# EAGLE design motoko_ice_dragon (EAGLE 9.6.0)
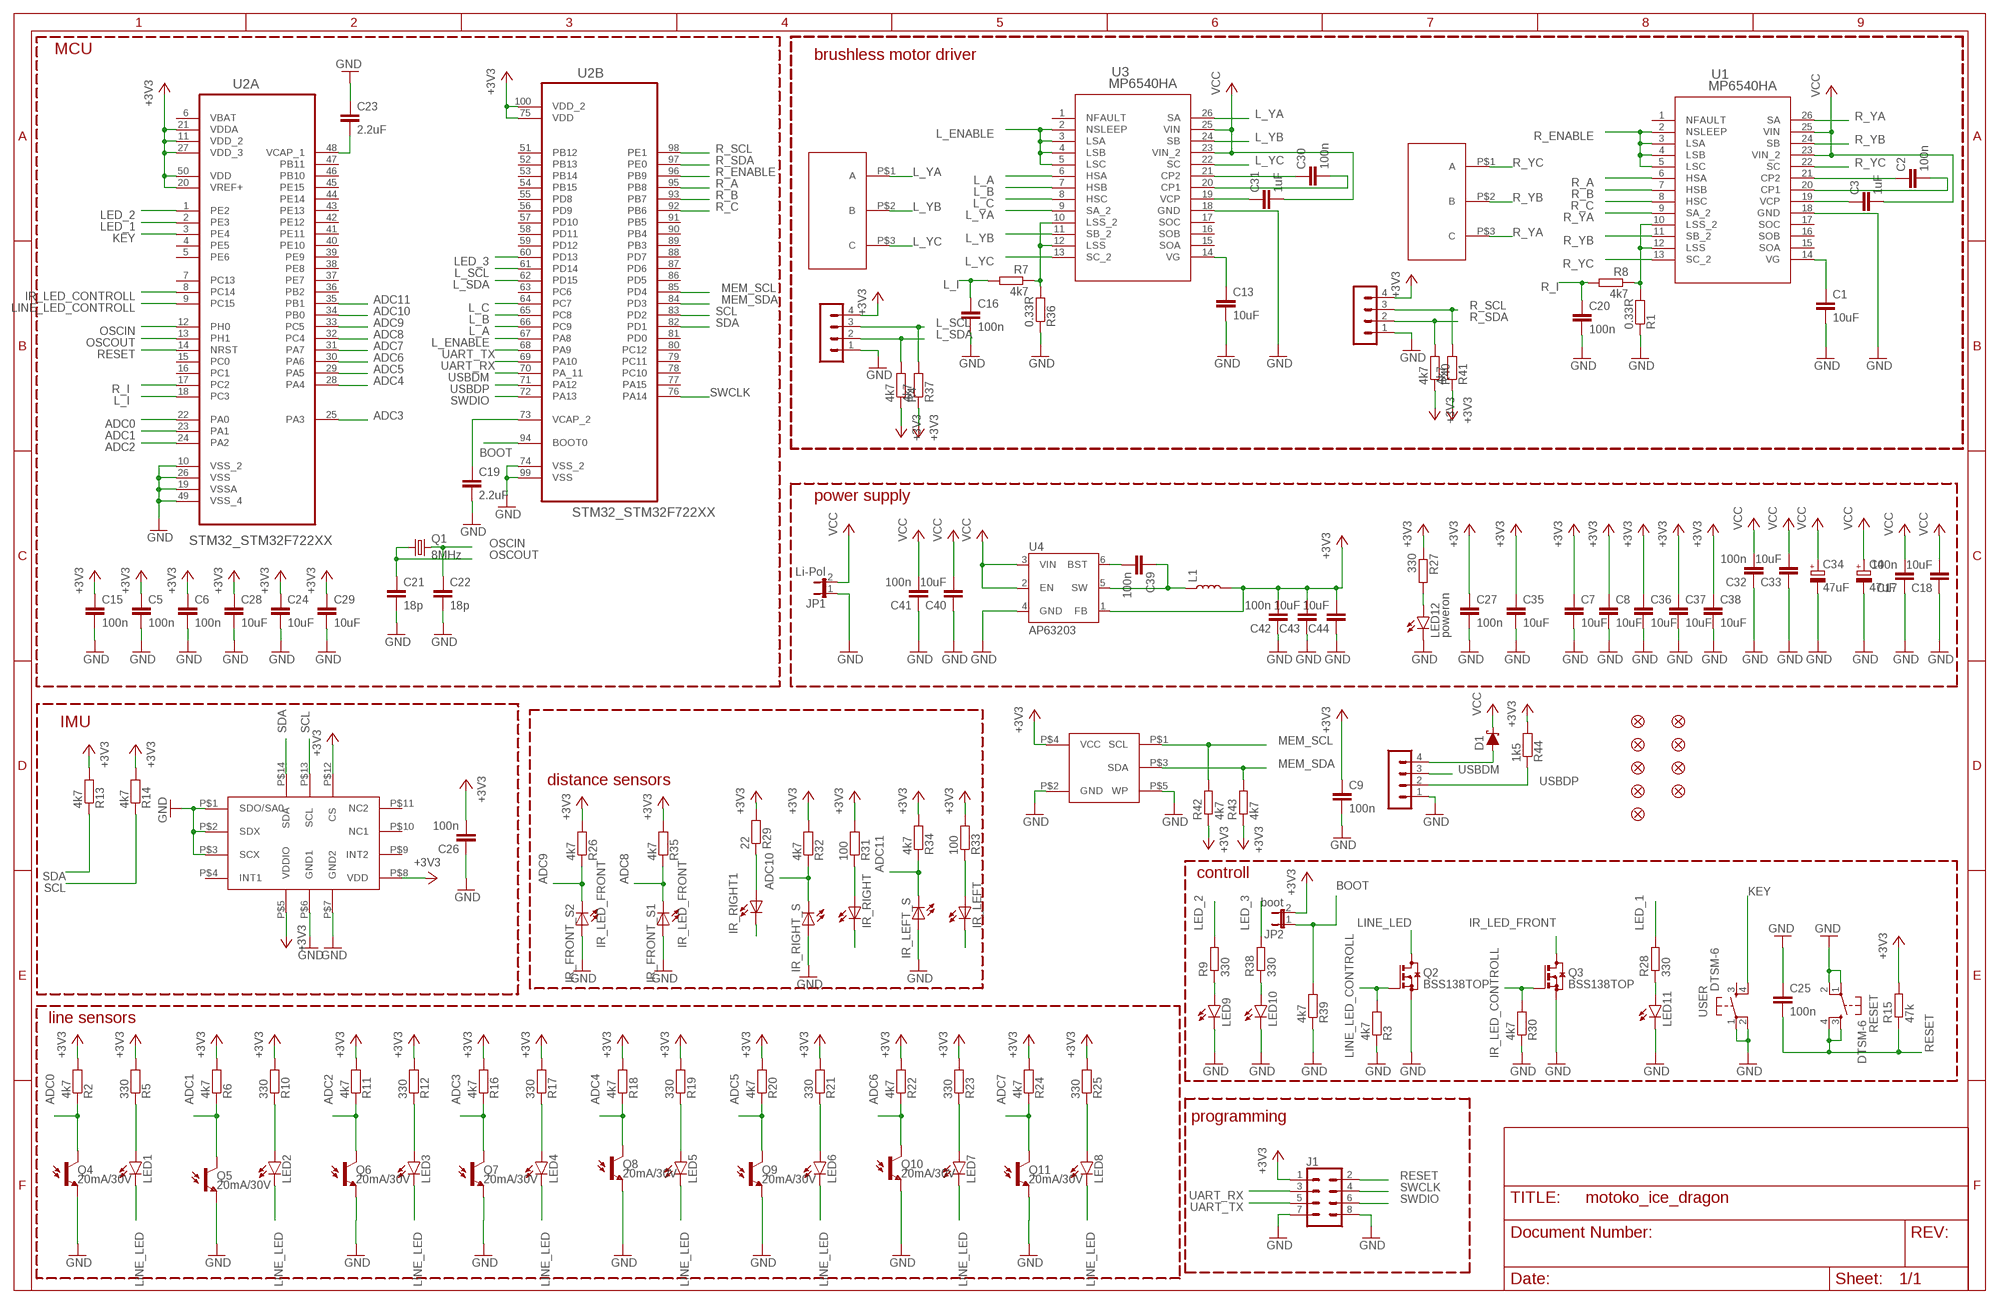
[diagram p0: schematic, sheet 1]

## Parts
C1  10uF  C-EUC0805  [C0805]
C2  100n  C-EUC0805  [C0805]
C3  1uF  C-EUC0805  [C0805]
C4  47uF  CPOL-EU140CLH-1010  [140CLH-1010]
C5  100n  C-EUC0805  [C0805]
C6  100n  C-EUC0805  [C0805]
C7  10uF  C-EUC0805  [C0805]
C8  10uF  C-EUC0805  [C0805]
C9  100n  C-EUC0805  [C0805]
C13  10uF  C-EUC0805  [C0805]
C15  100n  C-EUC0805  [C0805]
C16  100n  C-EUC0805  [C0805]
C17  100n  C-EUC0805  [C0805]
C18  10uF  C-EUC0805  [C0805]
C19  2.2uF  C-EUC0805  [C0805]
C20  100n  C-EUC0805  [C0805]
C21  18p  C-EUC0805  [C0805]
C22  18p  C-EUC0805  [C0805]
C23  2.2uF  C-EUC0805  [C0805]
C24  10uF  C-EUC0805  [C0805]
C25  100n  C-EUC0805  [C0805]
C26  100n  C-EUC0805  [C0805]
C27  100n  C-EUC0805  [C0805]
C28  10uF  C-EUC0805  [C0805]
C29  10uF  C-EUC0805  [C0805]
C30  100n  C-EUC0805  [C0805]
C31  1uF  C-EUC0805  [C0805]
C32  100n  C-EUC0805  [C0805]
C33  10uF  C-EUC0805  [C0805]
C34  47uF  CPOL-EU140CLH-1010  [140CLH-1010]
C35  10uF  C-EUC0805  [C0805]
C36  10uF  C-EUC0805  [C0805]
C37  10uF  C-EUC0805  [C0805]
C38  10uF  C-EUC0805  [C0805]
C39  100n  C-EUC0805  [C0805]
C40  10uF  C-EUC0805  [C0805]
C41  100n  C-EUC0805  [C0805]
C42  100n  C-EUC0805  [C0805]
C43  10uF  C-EUC0805  [C0805]
C44  10uF  C-EUC0805  [C0805]
D1  3A/40V/500mV  DIODE-SCHOTTKY-B340A  [SMA-DIODE]
FD1  FIDUCIAL1X2  [FIDUCIAL-1X2]
FD2  FIDUCIAL1X2  [FIDUCIAL-1X2]
FD3  FIDUCIAL1X2  [FIDUCIAL-1X2]
FD4  FIDUCIAL1X2  [FIDUCIAL-1X2]
FD5  FIDUCIAL1X2  [FIDUCIAL-1X2]
FD6  FIDUCIAL1X2  [FIDUCIAL-1X2]
FD7  FIDUCIAL1X2  [FIDUCIAL-1X2]
FD8  FIDUCIAL1X2  [FIDUCIAL-1X2]
FD9  FIDUCIAL1X2  [FIDUCIAL-1X2]
IR_FRONT_S1  LED5MM  [LED5MM]
IR_FRONT_S2  LED5MM  [LED5MM]
IR_LEFT  LED5MM  [LED5MM]
IR_LEFT_S  LED5MM  [LED5MM]
IR_RIGHT  LED5MM  [LED5MM]
IR_RIGHT1  LED5MM  [LED5MM]
IR_RIGHT_S  LED5MM  [LED5MM]
J1  CONN_04X2  [2X4]
JP1  Li-Pol  JP1E  [JP1]
JP2  boot  JP1E  [JP1]
L1  4.7uH, TYS50204R7N-10  INDUCTOR-CR54-3.3UH  [CR54]
L_ENCODER  MA04-1  [MA04-1]
L_ENCODER1  MA04-1  [MA04-1]
L_ENCODER2  MA04-1  [MA04-1]
LED1  LEDCHIPLED_1206  [CHIPLED_1206]
LED2  LEDCHIPLED_1206  [CHIPLED_1206]
LED3  LEDCHIPLED_1206  [CHIPLED_1206]
LED4  LEDCHIPLED_1206  [CHIPLED_1206]
LED5  LEDCHIPLED_1206  [CHIPLED_1206]
LED6  LEDCHIPLED_1206  [CHIPLED_1206]
LED7  LEDCHIPLED_1206  [CHIPLED_1206]
LED8  LEDCHIPLED_1206  [CHIPLED_1206]
LED9  LEDCHIPLED_1206  [CHIPLED_1206]
LED10  LEDCHIPLED_1206  [CHIPLED_1206]
LED11  LEDCHIPLED_1206  [CHIPLED_1206]
LED12  poweron  LEDCHIPLED_1206  [CHIPLED_1206]
Q1  8MHz  CRYSTALCTS406  [CTS406]
Q2  BSS138TOP  [SOT23]
Q3  BSS138TOP  [SOT23]
Q4  20mA/30V  PHOTOTRANSISTORPT17-21C-L41-TR8  [PT17-21C-L41-TR8]
Q5  20mA/30V  PHOTOTRANSISTORPT17-21C-L41-TR8  [PT17-21C-L41-TR8]
Q6  20mA/30V  PHOTOTRANSISTORPT17-21C-L41-TR8  [PT17-21C-L41-TR8]
Q7  20mA/30V  PHOTOTRANSISTORPT17-21C-L41-TR8  [PT17-21C-L41-TR8]
Q8  20mA/30V  PHOTOTRANSISTORPT17-21C-L41-TR8  [PT17-21C-L41-TR8]
Q9  20mA/30V  PHOTOTRANSISTORPT17-21C-L41-TR8  [PT17-21C-L41-TR8]
Q10  20mA/30V  PHOTOTRANSISTORPT17-21C-L41-TR8  [PT17-21C-L41-TR8]
Q11  20mA/30V  PHOTOTRANSISTORPT17-21C-L41-TR8  [PT17-21C-L41-TR8]
R1  0.33R  R-EU_M1206  [M1206]
R2  4k7  R-EU_M0805  [M0805]
R3  4k7  R-EU_M0805  [M0805]
R4  4k7  R-EU_M0805  [M0805]
R5  330  R-EU_M0805  [M0805]
R6  4k7  R-EU_M0805  [M0805]
R7  4k7  R-EU_M0805  [M0805]
R8  4k7  R-EU_M0805  [M0805]
R9  330  R-EU_M0805  [M0805]
R10  330  R-EU_M0805  [M0805]
R11  4k7  R-EU_M0805  [M0805]
R12  330  R-EU_M0805  [M0805]
R13  4k7  R-EU_M0805  [M0805]
R14  4k7  R-EU_M0805  [M0805]
R15  47k  R-EU_M0805  [M0805]
R16  4k7  R-EU_M0805  [M0805]
R17  330  R-EU_M0805  [M0805]
R18  4k7  R-EU_M0805  [M0805]
R19  330  R-EU_M0805  [M0805]
R20  4k7  R-EU_M0805  [M0805]
R21  330  R-EU_M0805  [M0805]
R22  4k7  R-EU_M0805  [M0805]
R23  330  R-EU_M0805  [M0805]
R24  4k7  R-EU_M0805  [M0805]
R25  330  R-EU_M0805  [M0805]
R26  4k7  R-EU_M0805  [M0805]
R27  330  R-EU_M0805  [M0805]
R28  330  R-EU_M0805  [M0805]
R29  22  R-EU_M0805  [M0805]
R30  4k7  R-EU_M0805  [M0805]
R31  100  R-EU_M0805  [M0805]
R32  4k7  R-EU_M0805  [M0805]
R33  100  R-EU_M0805  [M0805]
R34  4k7  R-EU_M0805  [M0805]
R35  4k7  R-EU_M0805  [M0805]
R36  0.33R  R-EU_M1206  [M1206]
R37  4k7  R-EU_M0805  [M0805]
R38  330  R-EU_M0805  [M0805]
R39  4k7  R-EU_M0805  [M0805]
R40  4k7  R-EU_M0805  [M0805]
R41  4k7  R-EU_M0805  [M0805]
R42  4k7  R-EU_M0805  [M0805]
R43  4k7  R-EU_M0805  [M0805]
R44  1k5  R-EU_M0805  [M0805]
RESET  DTSM-6  [DTSM-6]
U1  MP6540HA  [QFN-5X5_MP6540HA_MNP]
U2  STM32_STM32F722XX  [STM32_QFP50P1600X1600X160-100N]
U3  MP6540HA  [QFN-5X5_MP6540HA_MNP]
U4  AP63203  [SOT23-6]
U$1  BRUSHLESS_GIMBAL_MOTOR_WHEEL  [BRUSHLESS_GIMBAL_MOTOR_WHEEL]
U$2  BRUSHLESS_GIMBAL_MOTOR_WHEEL  [BRUSHLESS_GIMBAL_MOTOR_WHEEL]
U$3  LSM6DSM  [LGA14L]
U$4  24LC24_SOT23  [SOT23]
USER  DTSM-6  [DTSM-6]

## Nets
+3V3: C5.1 C6.1 C7.1 C8.1 C9.1 C15.1 C24.1 C26.2 C27.1 C28.1 C29.1 C35.1 C36.1 C37.1 C38.1 C42.2 C43.2 C44.2 J1.1 JP2.2 L1.P$2 L_ENCODER1.4 L_ENCODER.4 R2.2 R4.1 R5.2 R6.2 R10.2 R11.2 R12.2 R13.2 R14.2 R15.2 R16.2 R17.2 R18.2 R19.2 R20.2 R21.2 R22.2 R23.2 R24.2 R25.2 R26.2 R27.1 R29.2 R31.2 R32.2 R33.2 R34.2 R35.2 R37.1 R40.1 R41.1 R42.1 R43.1 R44.2 U2.11(A:VDD_2) U2.20(A:VREF+) U2.21(A:VDDA) U2.27(A:VDD_3) U2.50(A:VDD) U2.75(B:VDD) U2.100(B:VDD_2) U4.1(FB) U$3.P$5(VDDIO) U$3.P$8(VDD) U$3.P$12(CS) U$4.P$4(VCC)
ADC0: Q4.C R2.1 U2.22(A:PA0)
ADC1: Q5.C R6.1 U2.23(A:PA1)
ADC2: Q6.C R11.1 U2.24(A:PA2)
ADC3: Q7.C R16.1 U2.25(A:PA3)
ADC4: Q8.C R18.1 U2.28(A:PA4)
ADC5: Q9.C R20.1 U2.29(A:PA5)
ADC6: Q10.C R22.1 U2.30(A:PA6)
ADC7: Q11.C R24.1 U2.31(A:PA7)
ADC8: IR_FRONT_S1.K(C) R35.1 U2.32(A:PC4)
ADC9: IR_FRONT_S2.K(C) R26.1 U2.33(A:PC5)
ADC10: IR_RIGHT_S.K(C) R32.1 U2.34(A:PB0)
ADC11: IR_LEFT_S.K(C) R34.1 U2.35(A:PB1)
BOOT: JP2.1 R39.2 U2.94(B:BOOT0)
GND: C1.2 C4.- C5.2 C6.2 C7.2 C8.2 C9.2 C13.2 C15.2 C16.2 C17.1 C18.1 C19.2 C20.2 C21.2 C22.2 C23.1 C24.2 C25.1 C26.1 C27.2 C28.2 C29.2 C32.1 C33.1 C34.- C35.2 C36.2 C37.2 C38.2 C40.1 C41.1 C42.1 C43.1 C44.1 IR_FRONT_S1.A IR_FRONT_S2.A IR_LEFT_S.A IR_RIGHT_S.A J1.7 J1.8 JP1.1 L_ENCODER1.1 L_ENCODER2.1 L_ENCODER.1 LED9.C LED10.C LED11.C LED12.C Q2.2(S) Q3.2(S) Q4.E Q5.E Q6.E Q7.E Q8.E Q9.E Q10.E Q11.E R1.1 R3.1 R30.1 R36.1 R39.1 RESET.1 RESET.2 U1.18(GND) U2.10(A:VSS_2) U2.19(A:VSSA) U2.26(A:VSS) U2.49(A:VSS_4) U2.74(B:VSS_2) U2.99(B:VSS) U3.18(GND) U4.4(GND) U$3.P$1(SDO/SA0) U$3.P$2(SDX) U$3.P$3(SCX) U$3.P$6(GND1) U$3.P$7(GND2) U$4.P$2(GND) U$4.P$5(WP) USER.1 USER.2
IR_LED_CONTROLL: Q3.1(G) R30.2 U2.8(A:PC14)
IR_LED_FRONT: IR_LEFT.K(C) IR_RIGHT1.K(C) IR_RIGHT.K(C) Q3.3(D)
KEY: U2.3(A:PE4) USER.4
L_A: U2.66(B:PC9) U3.6(HSA)
L_B: U2.65(B:PC8) U3.7(HSB)
L_C: U2.64(B:PC7) U3.8(HSC)
L_ENABLE: U2.67(B:PA8) U3.2(NSLEEP) U3.3(LSA) U3.4(LSB) U3.5(LSC)
L_I: C16.1 R7.2 U2.18(A:PC3)
L_SCL: L_ENCODER.3 R37.2 U2.61(B:PD14)
L_SDA: L_ENCODER.2 R4.2 U2.62(B:PD15)
L_YA: U3.9(SA_2) U3.26(SA) U$1.P$1(A)
L_YB: U3.11(SB_2) U3.24(SB) U$1.P$2(B)
L_YC: U3.13(SC_2) U3.22(SC) U$1.P$3(C)
LED_1: R28.2 U2.2(A:PE3)
LED_2: R9.2 U2.1(A:PE2)
LED_3: R38.2 U2.60(B:PD13)
LINE_LED: LED1.C LED2.C LED3.C LED4.C LED5.C LED6.C LED7.C LED8.C Q2.3(D)
LINE_LED_CONTROLL: Q2.1(G) R3.2 U2.9(A:PC15)
MEM_SCL: R42.2 U2.85(B:PD4) U$4.P$1(SCL)
MEM_SDA: R43.2 U2.84(B:PD3) U$4.P$3(SDA)
N$1: R7.1 R36.2 U3.10(LSS_2) U3.12(LSS)
N$2: C1.1 U1.14(VG)
N$3: C2.1 U1.21(CP2)
N$4: C2.2 U1.20(CP1)
N$5: C3.1 U1.19(VCP)
N$7: IR_RIGHT1.A R29.1
N$8: R1.2 R8.1 U1.10(LSS_2) U1.12(LSS)
N$9: LED9.A R9.1
N$10: C13.1 U3.14(VG)
N$11: LED10.A R38.1
N$12: C31.1 U3.19(VCP)
N$13: IR_LEFT.A R33.1
N$14: LED1.A R5.1
N$15: LED2.A R10.1
N$16: LED3.A R12.1
N$17: LED4.A R17.1
N$18: LED5.A R19.1
N$19: LED6.A R21.1
N$20: LED7.A R23.1
N$21: LED8.A R25.1
N$22: C39.2 U4.6(BST)
N$23: LED12.A R27.2
N$24: IR_RIGHT.A R31.1
N$25: C19.1 U2.73(B:VCAP_2)
N$26: C39.1 L1.P$1 U4.5(SW)
N$28: D1.A L_ENCODER2.4
N$30: C23.2 U2.48(A:VCAP_1)
N$31: C30.1 U3.21(CP2)
N$33: LED11.A R28.1
N$34: C30.2 U3.20(CP1)
OSCIN: C22.1 Q1.3 U2.12(A:PH0)
OSCOUT: C21.1 Q1.1 U2.13(A:PH1)
R_A: U1.6(HSA) U2.95(B:PB8)
R_B: U1.7(HSB) U2.93(B:PB7)
R_C: U1.8(HSC) U2.92(B:PB6)
R_ENABLE: U1.2(NSLEEP) U1.3(LSA) U1.4(LSB) U1.5(LSC) U2.96(B:PB9)
R_I: C20.1 R8.2 U2.17(A:PC2)
R_SCL: L_ENCODER1.3 R41.2 U2.98(B:PE1)
R_SDA: L_ENCODER1.2 R40.2 U2.97(B:PE0)
R_YA: U1.9(SA_2) U1.26(SA) U$2.P$3(C)
R_YB: U1.11(SB_2) U1.24(SB) U$2.P$2(B)
R_YC: U1.13(SC_2) U1.22(SC) U$2.P$1(A)
RESET: C25.2 J1.2 R15.1 RESET.3 RESET.4 U2.14(A:NRST)
SCL: R14.1 U2.83(B:PD2) U$3.P$13(SCL)
SDA: R13.1 U2.82(B:PD1) U$3.P$14(SDA)
SWCLK: J1.4 U2.76(B:PA14)
SWDIO: J1.6 U2.72(B:PA13)
UART_RX: J1.3 U2.69(B:PA10)
UART_TX: J1.5 U2.68(B:PA9)
USBDM: L_ENCODER2.3 U2.70(B:PA_11)
USBDP: L_ENCODER2.2 R44.1 U2.71(B:PA12)
VCC: C3.2 C4.+ C17.2 C18.2 C31.2 C32.2 C33.2 C34.+ C40.2 C41.2 D1.C JP1.2 U1.23(VIN_2) U1.25(VIN) U3.23(VIN_2) U3.25(VIN) U4.2(EN) U4.3(VIN)
Unconnected: U1.1(NFAULT) U1.15(SOA) U1.16(SOB) U1.17(SOC) U2.4(A:PE5) U2.5(A:PE6) U2.7(A:PC13) U2.15(A:PC0) U2.16(A:PC1) U2.36(A:PB2) U2.37(A:PE7) U2.38(A:PE8) U2.39(A:PE9) U2.40(A:PE10) U2.41(A:PE11) U2.42(A:PE12) U2.43(A:PE13) U2.44(A:PE14) U2.45(A:PE15) U2.46(A:PB10) U2.47(A:PB11) U2.51(B:PB12) U2.52(B:PB13) U2.53(B:PB14) U2.54(B:PB15) U2.55(B:PD8) U2.56(B:PD9) U2.57(B:PD10) U2.58(B:PD11) U2.59(B:PD12) U2.63(B:PC6) U2.77(B:PA15) U2.78(B:PC10) U2.79(B:PC11) U2.80(B:PC12) U2.81(B:PD0) U2.86(B:PD5) U2.87(B:PD6) U2.88(B:PD7) U2.89(B:PB3) U2.90(B:PB4) U2.91(B:PB5) U3.1(NFAULT) U3.15(SOA) U3.16(SOB) U3.17(SOC) U$3.P$4(INT1) U$3.P$9(INT2) U$3.P$10(NC1) U$3.P$11(NC2) USER.3

## Notes on the sheet
- MCU
- brushless motor driver
- power supply
- IMU
- distance sensors
- controll
- line sensors
- programming

## Power pins joined to a net without a drawn wire
VBAT: U2.6(A:VBAT)

## Library data of the parts
C1-C3 C5-C9 C13 C15-C33 C35-C44 = resistor:C-EU: CAPACITOR, European symbol
C4 C34 = rcl:CPOL-EU: POLARIZED CAPACITOR, European symbol; SPICEPREFIX: C
D1 = SparkFun-DiscreteSemi:DIODE-SCHOTTKY: Schottky diode A Schottky diode is a semiconductor diode which has a low forward voltage drop and a very fast switching action.; PROD_ID: DIO-09886
FD1-FD9 = SparkFun-Aesthetics:FIDUCIAL: Fiducial Alignment Points Point-of-reference for pick-and-place machines and other optical instruments.
IR_FRONT_S1 IR_FRONT_S2 IR_LEFT IR_LEFT_S IR_RIGHT IR_RIGHT1 IR_RIGHT_S = my_parts:LED: LED OSRAM: - CHIPLED LG R971, LG N971, LY N971, LG Q971, LY Q971, LO R971, LY R971 LH N974, LH R974 LS Q976, LO Q976, LY Q976 LO Q996 - Hyper CHIPLED LW Q18S LB Q993, LB Q99A, LB R99A - SideLED LS A670, LO A670, LY A670, LG A670, LP A670 LB A673, LV A673, LT A673, LW A673 LH A674 LY A675 LS A676, LA A676, LO A676, LY A676, LW A676 LS A679, LY A679, LG A679 - Hyper Micro SIDELED® LS Y876, LA Y876, LO Y876, LY Y876 LT Y87S - SmartLED LW L88C, LW L88S LB L89C, LB L89S, LG L890 LS L89K, LO L89K, LY L89K LS L896, LA L896, LO L896, LY L896 - TOPLED LS T670, LO T670, LY T670, LG T670, LP T670 LSG T670, LSP T670, LSY T670, LOP T670, LYG T670 LG T671, LOG T671, LSG T671 LB T673, LV T673, LT T673, LW T673 LH T674 LS T676, LA T676, LO T676, LY T676, LB T676, LH T676, LSB T676, LW T676 LB T67C, LV T67C, LT T67C, LS T67K, LO T67K, LY T67K, LW E67C LS E67B, LA E67B, LO E67B, LY E67B, LB E67C, LV E67C, LT E67C LW T67C LS T679, LY T679, LG T679 LS T770, LO T770, LY T770, LG T770, LP T770 LB T773, LV T773, LT T773, LW T773 LH T774 LS E675, LA E675, LY E675, LS T675 LS T776, LA T776, LO T776, LY T776, LB T776 LHGB T686 LT T68C, LB T68C - Hyper Mini TOPLED® LB M676 - Mini TOPLED Santana® LG M470 LS M47K, LO M47K, LY M47K Source: http://www.osram.convergy.de LUXEON: - LUMILED® LXK2-PW12-R00, LXK2-PW12-S00, LXK2-PW14-U00, LXK2-PW14-V00 LXK2-PM12-R00, LXK2-PM12-S00, LXK2-PM14-U00 LXK2-PE12-Q00, LXK2-PE12-R00, LXK2-PE12-S00, LXK2-PE14-T00, LXK2-PE14-U00 LXK2-PB12-K00, LXK2-PB12-L00, LXK2-PB12-M00, LXK2-PB14-N00, LXK2-PB14-P00, LXK2-PB14-Q00 LXK2-PR12-L00, LXK2-PR12-M00, LXK2-PR14-Q00, LXK2-PR14-R00 LXK2-PD12-Q00, LXK2-PD12-R00, LXK2-PD12-S00 LXK2-PH12-R00, LXK2-PH12-S00 LXK2-PL12-P00, LXK2-PL12-Q00, LXK2-PL12-R00 Source: www.luxeon.com KINGBRIGHT: KA-3528ASYC Source: www.kingbright.com
J1 = SparkFun-Connectors:CONN_04X2: Multi connection point. Often used as Generic Header-pin footprint for 0.1 inch spaced/style header connections On any of the 0.1 inch spaced packages, you can populate with these: Break Away Headers - Straight <https://www.sparkfun.com/products/116> (PRT-00116) Break Away Male Headers - Right Angle <https://www.sparkfun.com/products/553> (PRT-00553) Female Headers <https://www.sparkfun.com/products/115> (PRT-00115) Break Away Headers - Machine Pin <https://www.sparkfun.com/products/117> (PRT-00117) Break Away Female Headers - Swiss Machine Pin <https://www.sparkfun.com/products/743> (PRT-00743)
JP1 JP2 = jumper:JP1E: JUMPER
L1 = SparkFun-Coils:INDUCTOR: Inductors Resist changes in electrical current. Basically a coil of wire. SparkFun Products: SparkFun Load Cell Amplifier - HX711 <https://www.sparkfun.com/products/13879> IOIO-OTG - V2.2 <https://www.sparkfun.com/products/13613>; PROD_ID: NDUC-11157; VALUE: 3.3µH/±30%/3.4A
L_ENCODER L_ENCODER1 L_ENCODER2 = con-lstb:MA04-1: PIN HEADER; OC_FARNELL: unknown; OC_NEWARK: unknown
LED1-LED12 = led:LED: LED OSRAM: - CHIPLED LG R971, LG N971, LY N971, LG Q971, LY Q971, LO R971, LY R971 LH N974, LH R974 LS Q976, LO Q976, LY Q976 LO Q996 - Hyper CHIPLED LW Q18S LB Q993, LB Q99A, LB R99A - SideLED LS A670, LO A670, LY A670, LG A670, LP A670 LB A673, LV A673, LT A673, LW A673 LH A674 LY A675 LS A676, LA A676, LO A676, LY A676, LW A676 LS A679, LY A679, LG A679 - Hyper Micro SIDELED® LS Y876, LA Y876, LO Y876, LY Y876 LT Y87S - SmartLED LW L88C, LW L88S LB L89C, LB L89S, LG L890 LS L89K, LO L89K, LY L89K LS L896, LA L896, LO L896, LY L896 - TOPLED LS T670, LO T670, LY T670, LG T670, LP T670 LSG T670, LSP T670, LSY T670, LOP T670, LYG T670 LG T671, LOG T671, LSG T671 LB T673, LV T673, LT T673, LW T673 LH T674 LS T676, LA T676, LO T676, LY T676, LB T676, LH T676, LSB T676, LW T676 LB T67C, LV T67C, LT T67C, LS T67K, LO T67K, LY T67K, LW E67C LS E67B, LA E67B, LO E67B, LY E67B, LB E67C, LV E67C, LT E67C LW T67C LS T679, LY T679, LG T679 LS T770, LO T770, LY T770, LG T770, LP T770 LB T773, LV T773, LT T773, LW T773 LH T774 LS E675, LA E675, LY E675, LS T675 LS T776, LA T776, LO T776, LY T776, LB T776 LHGB T686 LT T68C, LB T68C - Hyper Mini TOPLED® LB M676 - Mini TOPLED Santana® LG M470 LS M47K, LO M47K, LY M47K Source: http://www.osram.convergy.de LUXEON: - LUMILED® LXK2-PW12-R00, LXK2-PW12-S00, LXK2-PW14-U00, LXK2-PW14-V00 LXK2-PM12-R00, LXK2-PM12-S00, LXK2-PM14-U00 LXK2-PE12-Q00, LXK2-PE12-R00, LXK2-PE12-S00, LXK2-PE14-T00, LXK2-PE14-U00 LXK2-PB12-K00, LXK2-PB12-L00, LXK2-PB12-M00, LXK2-PB14-N00, LXK2-PB14-P00, LXK2-PB14-Q00 LXK2-PR12-L00, LXK2-PR12-M00, LXK2-PR14-Q00, LXK2-PR14-R00 LXK2-PD12-Q00, LXK2-PD12-R00, LXK2-PD12-S00 LXK2-PH12-R00, LXK2-PH12-S00 LXK2-PL12-P00, LXK2-PL12-Q00, LXK2-PL12-R00 Source: www.luxeon.com KINGBRIGHT: KA-3528ASYC Source: www.kingbright.com
Q1 = crystal:CRYSTAL: CRYSTAL; OC_FARNELL: unknown; OC_NEWARK: unknown
Q2 Q3 = JCM:BSS138
Q4-Q11 = SparkFun-DiscreteSemi:PHOTOTRANSISTOR: Phototransistor PT17-21C/L41/TR8 is a phototransistor in miniature SMD package which is molded in a water clear with flat top view lens. The device is Spectrally matched to visible and infrared emitting diode. Datasheet <http://www.everlight.com/file/ProductFile/PT17-21C-L41-TR8.pdf> SparkFun Products: SparkFun Electric Imp imp002 Breakout <https://www.sparkfun.com/products/12958>; PROD_ID: TRANS-12141
R1 R36 R42 R43 = rcl:R-EU_: RESISTOR, European symbol; SPICEPREFIX: R
R2-R35 R37-R41 R44 = resistor:R-EU_: RESISTOR, European symbol
RESET USER = switch-tact:DTSM-6
U1 U3 = my_library:MP6540HA; BUILT_BY: EMA_Justin; COPYRIGHT: Copyright (C) 2018 Accelerated Designs. All rights reserved; DATASHEET: https://www.monolithicpower.com/en/documentview/productdocument/index/version/2/document_type/Datasheet/lang/en/sku/MP6540HA/document_id/6884/; MANUFACTURER_PART_NUMBER: MP6540HA; SOURCELIBRARY: Monolithic_Power_Systems_2020-10-09; VENDOR: Monolithic Power Systems Inc
U2 = ascender_board:STM32_STM32F722XX: IC, MCU, 32BIT, 512K FLASH, 100LQFP; MPN: STM32F407VET6; OC_FARNELL: 2064367; OC_NEWARK: 73T2332; PACKAGE: 100LQFP; SUPPLIER: STMicroelectronics
U4 = SparkFun-IC-Power:AP63203: Diodes Inc. AP63203 3.8V-32V input 3.3V Buck The AP63200/AP63201/AP63203/AP63205 is a 2A, synchronous buck converter with a wide input voltage range of 3.8V to 32V and fully integrates a 125mΩ high-side power MOSFET and a 68mΩ lowside power MOSFET to provide high-efficiency step-down DC/DC conversion; PROD_ID: VREG-15244
U$1 U$2 = my_library:BRUSHLESS_GIMBAL_MOTOR_WHEEL
U$3 = my_library:LSM6DSM
U$4 = my_library:24LC24_SOT23

## Board
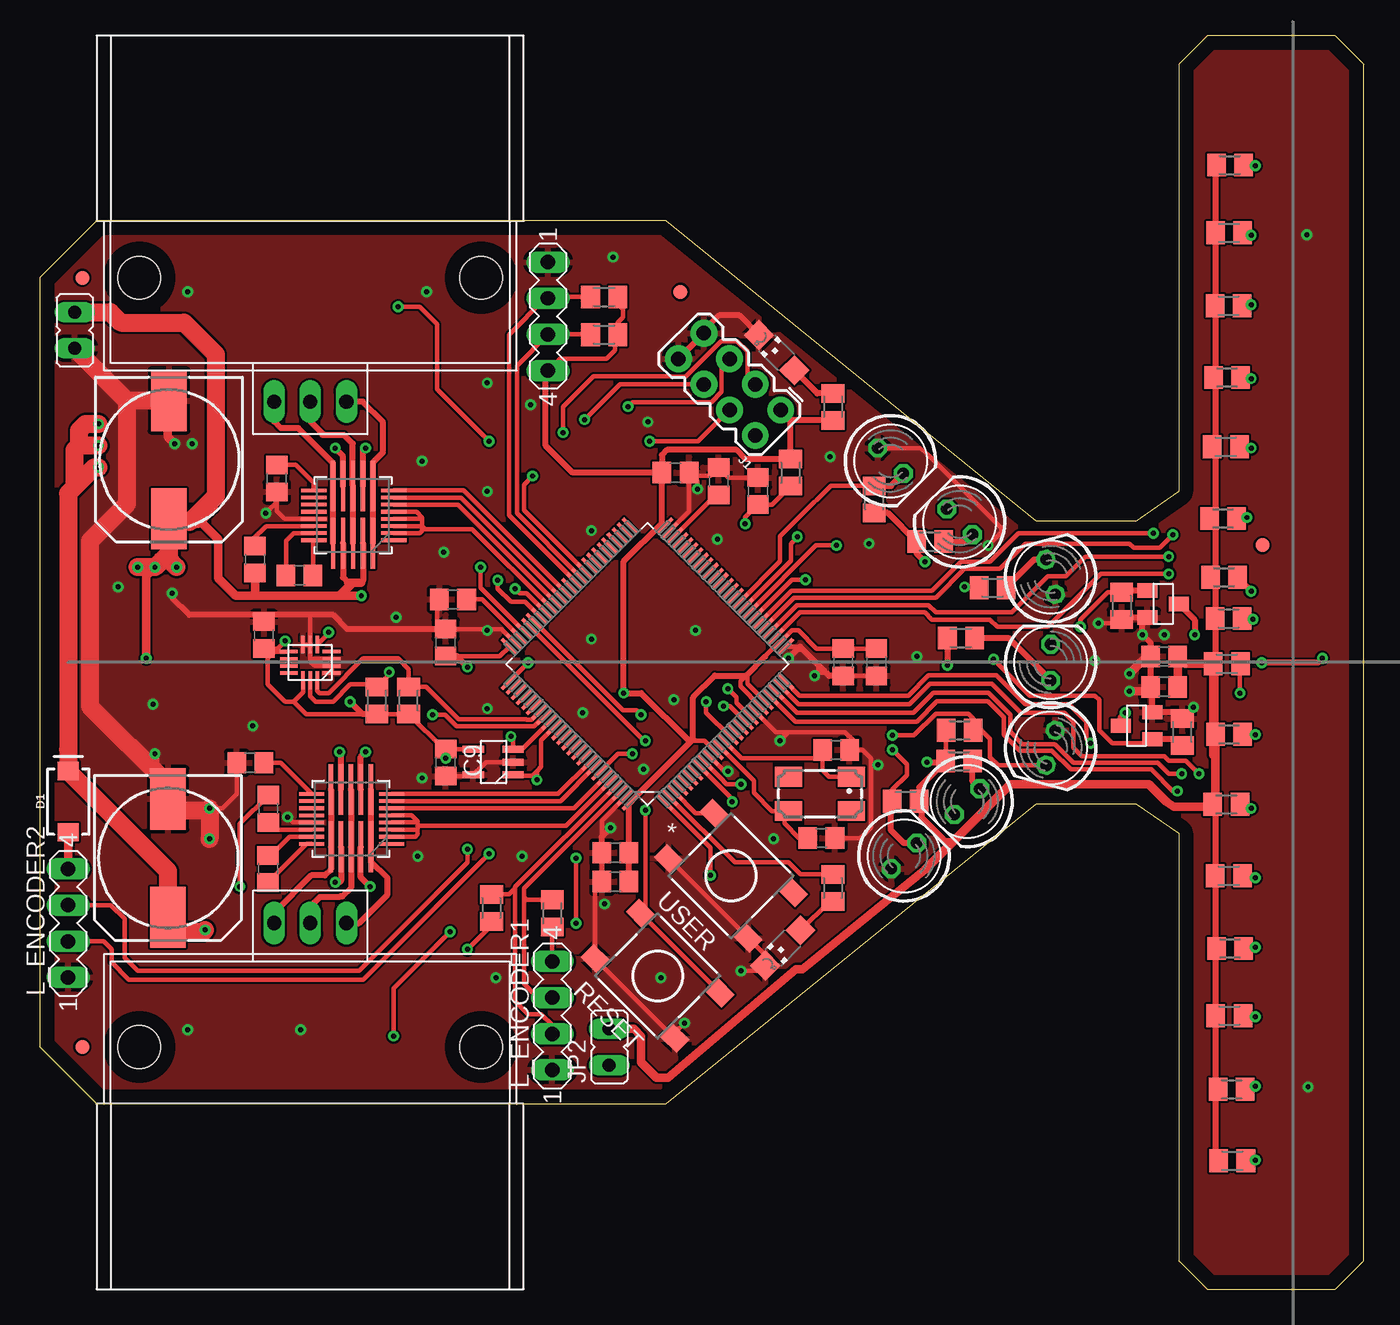
[diagram p1: board, top side]
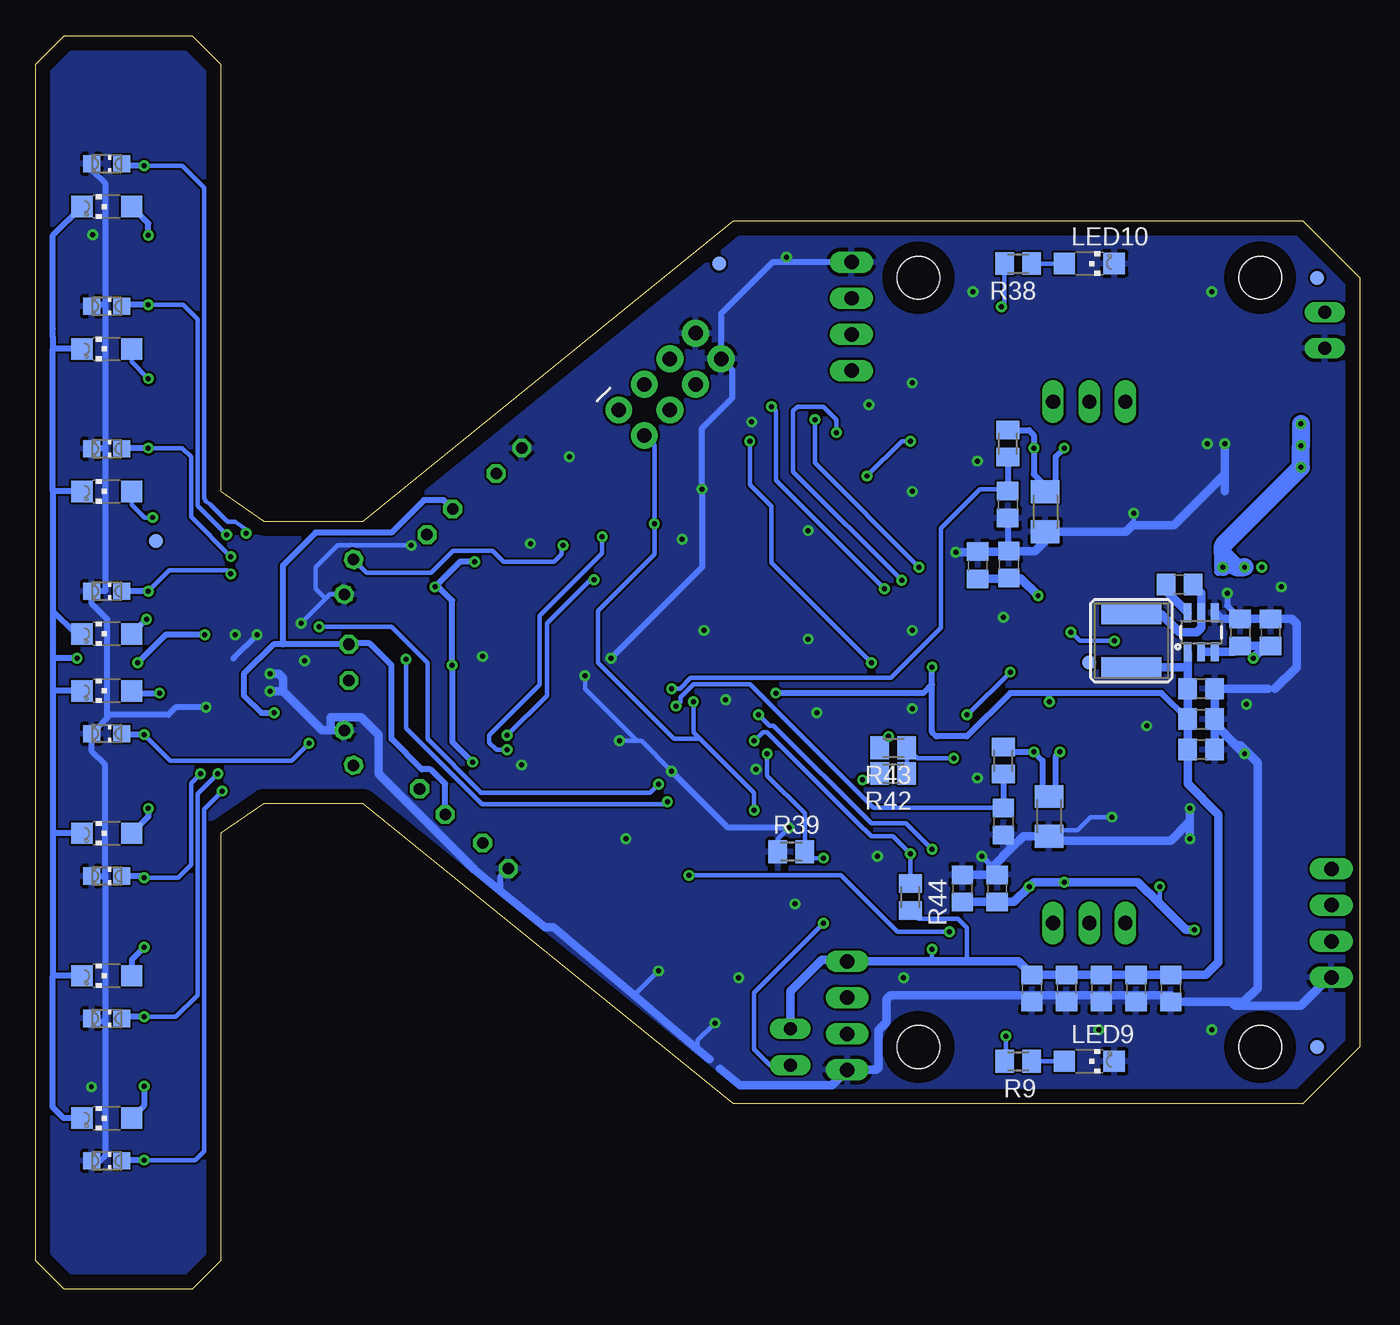
[diagram p2: board, bottom side, seen from below]

Size 93 x 88 mm. Coordinates in mm from the lower left corner, seen from the top.
Outline: 4,13 44,13 70,34.09 77,34.09 80,32 80,2 82,0 91,0 93,2 93,86 91,88 82,88 80,86 80,56 77,53.91 70,53.91 44,75 4,75 0,71 0,17 4,13
Copper layers (1*16): Top 0.035mm / dielectric 1.5mm / Bottom 0.035mm
Design rules "default": minimum track width 6mil, minimum drill 0.35mm, track to track 6mil, track to pad 6mil, pad to pad 6mil, via to via 6mil, smd to smd 6mil, copper to edge 40mil, drill to drill 6mil, minimum pad ring 10mil, minimum via ring 8mil, stop-mask expansion 4mil, vias tented up to drill 0mil, thermal gap 10mil

### Footprints (pad centres in the part's own frame; a part is rotated, then mirrored left to right if it is on the bottom)
C0805 = smd 1.3 x 1.5: 1 -0.95,0; 2 0.95,0
140CLH-1010 = smd 4.3 x 2.5: + 4.15,0; - -4.15,0
SMA-DIODE = smd 1.27 x 1.47: A -2.15,0; C 2.15,0
FIDUCIAL-1X2 = smd 1 x 1: 1 0,0
LED5MM = drill 0.813 octagon: A -1.27,0; K 1.27,0
2X4 = drill 1.016 pad 1.88: 1 -3.81,-1.27; 2 -3.81,1.27; 3 -1.27,-1.27; 4 -1.27,1.27; 5 1.27,-1.27; 6 1.27,1.27; 7 3.81,-1.27; 8 3.81,1.27
JP1 = drill 0.914 long: 1 0,-1.27; 2 0,1.27
CR54 = smd 4.2 x 1.4: P$1 0,1.85; P$2 0,-1.85
MA04-1 = drill 1.016 long: 1 -3.81,0; 2 -1.27,0; 3 1.27,0; 4 3.81,0
CHIPLED_1206 = smd 1.5 x 1.5: A 0,-1.75; C 0,1.75
CTS406 = smd 1.9 x 1.4: 1 -2.2,-1.2; 2 2.2,-1.2; 3 2.2,1.2; 4 -2.2,1.2
SOT23 = smd 1 x 1.4: 1 -0.95,-1.1; 2 0.95,-1.1; 3 0,1.1
PT17-21C-L41-TR8 = smd 1.2 x 1.2: C 0,1.05; E 0,-1.05
M1206 = smd 1.6 x 2: 1 -1.4,0; 2 1.4,0
M0805 = smd 1.3 x 1.6: 1 -0.95,0; 2 0.95,0
DTSM-6 = smd 1.55 x 1.3: 1 -3.975,2.25; 2 3.975,2.25; 3 -3.975,-2.25; 4 3.975,-2.25
QFN-5X5_MP6540HA_MNP = smd 1.778 x 0.254: 1 -2.858,1.75; 2 -2.858,1.25; 3 -2.858,0.75; 4 -2.858,0.25; 5 -2.858,-0.25; 6 -2.858,-0.75; 7 -2.858,-1.25; 8 -2.858,-1.75; 14 2.756,-1.75; 15 2.756,-1.25; 16 2.756,-0.75; 17 2.756,-0.25; 18 2.756,0.25; 19 2.756,0.75; 20 2.756,1.25; 21 2.756,1.75 | smd 0.305 x 3.556: 9 -1.4,-2.058; 10 -0.7,-2.058; 11 0,-2.058; 12 0.7,-2.058; 13 1.4,-2.058; 22 1.4,1.956; 23 0.7,1.956; 24 0,1.956; 25 -0.7,1.956; 26 -1.4,1.956
STM32_QFP50P1600X1600X160-100N = smd 1.473 x 0.254: 1 -7.722,5.994; 2 -7.722,5.512; 3 -7.722,5.004; 4 -7.722,4.496; 5 -7.722,3.988; 6 -7.722,3.505; 7 -7.722,2.997; 8 -7.722,2.489; 9 -7.722,2.007; 10 -7.722,1.499; 11 -7.722,0.991; 12 -7.722,0.508; 13 -7.722,0; 14 -7.722,-0.508; 15 -7.722,-0.991; 16 -7.722,-1.499; 17 -7.722,-2.007; 18 -7.722,-2.489; 19 -7.722,-2.997; 20 -7.722,-3.505; 21 -7.722,-3.988; 22 -7.722,-4.496; 23 -7.722,-5.004; 24 -7.722,-5.512; 25 -7.722,-5.994; 51 7.722,-5.994; 52 7.722,-5.512; 53 7.722,-5.004; 54 7.722,-4.496; 55 7.722,-3.988; 56 7.722,-3.505; 57 7.722,-2.997; 58 7.722,-2.489; 59 7.722,-2.007; 60 7.722,-1.499; 61 7.722,-0.991; 62 7.722,-0.508; 63 7.722,0; 64 7.722,0.508; 65 7.722,0.991; 66 7.722,1.499; 67 7.722,2.007; 68 7.722,2.489; 69 7.722,2.997; 70 7.722,3.505; 71 7.722,3.988; 72 7.722,4.496; 73 7.722,5.004; 74 7.722,5.512; 75 7.722,5.994 | smd 0.254 x 1.473: 26 -5.994,-7.722; 27 -5.512,-7.722; 28 -5.004,-7.722; 29 -4.496,-7.722; 30 -3.988,-7.722; 31 -3.505,-7.722; 32 -2.997,-7.722; 33 -2.489,-7.722; 34 -2.007,-7.722; 35 -1.499,-7.722; 36 -0.991,-7.722; 37 -0.508,-7.722; 38 0,-7.722; 39 0.508,-7.722; 40 0.991,-7.722; 41 1.499,-7.722; 42 2.007,-7.722; 43 2.489,-7.722; 44 2.997,-7.722; 45 3.505,-7.722; 46 3.988,-7.722; 47 4.496,-7.722; 48 5.004,-7.722; 49 5.512,-7.722; 50 5.994,-7.722; 76 5.994,7.722; 77 5.512,7.722; 78 5.004,7.722; 79 4.496,7.722; 80 3.988,7.722; 81 3.505,7.722; 82 2.997,7.722; 83 2.489,7.722; 84 2.007,7.722; 85 1.499,7.722; 86 0.991,7.722; 87 0.508,7.722; 88 0,7.722; 89 -0.508,7.722; 90 -0.991,7.722; 91 -1.499,7.722; 92 -2.007,7.722; 93 -2.489,7.722; 94 -2.997,7.722; 95 -3.505,7.722; 96 -3.988,7.722; 97 -4.496,7.722; 98 -5.004,7.722; 99 -5.512,7.722; 100 -5.994,7.722
SOT23-6 = smd 0.55 x 1.35: 1 -0.95,-1.375; 2 0,-1.375; 3 0.95,-1.375; 4 0.95,1.375; 5 0,1.375; 6 -0.95,1.375
BRUSHLESS_GIMBAL_MOTOR_WHEEL = drill 1 long: P$1 12.7,2.54; P$2 12.7,0; P$3 12.7,-2.54 | hole 3: 4,-12; 4,12
LGA14L = smd 1.25 x 0.25: P$1 -1.5,0.75; P$2 -1.5,0.25; P$3 -1.5,-0.25; P$4 -1.5,-0.75; P$8 1.5,-0.75; P$9 1.5,-0.25; P$10 1.5,0.25; P$11 1.5,0.75 | smd 0.25 x 1.25: P$5 -0.5,-1.25; P$6 0,-1.25; P$7 0.5,-1.25; P$12 0.5,1.25; P$13 0,1.25; P$14 -0.5,1.25
SOT23' = smd 0.5 x 1.5: P$1 -0.9,-0.5; P$2 0,-0.5; P$3 0.9,-0.5; P$4 0.9,2.3; P$5 -0.9,2.3

### Placement (x,y rotation side)
C1  14.79,36.95 180 top
C2  16.04,29.51 90 top
C3  16.06,33.72 90 top
C4  9.01,30.26 270 top
C5  44.65,57.32 0 top
C6  40.44,30.64 180 top
C7  20.59,21.12 270 bottom
C8  23.03,21.12 270 bottom
C9  28.52,36.97 270 top
C13  16.65,56.91 270 top
C15  28.51,45.38 90 top
C16  24.73,55.08 270 bottom
C17  27.91,28.13 270 bottom
C18  25.47,28.13 270 bottom
C19  29.03,48.42 180 top
C20  25.03,32.83 270 bottom
C21  55.93,37.85 0 top
C22  54.9,31.66 0 top
C23  47.68,56.71 270 top
C24  40.44,28.6 180 top
C25  50.44,56.02 270 top
C26  15.75,45.91 270 top
C27  78.98,44.42 180 top
C28  56.43,44.01 270 top
C29  58.76,44.01 270 top
C30  18.25,50.1 180 top
C31  15.13,51.22 270 top
C32  24.65,50.87 270 bottom
C33  26.83,50.82 270 bottom
C34  9.08,58.23 270 top
C35  78.98,42.28 180 top
C36  13.28,21.12 270 bottom
C37  18.15,21.12 270 bottom
C38  15.72,21.12 270 bottom
C39  12.67,49.46 180 bottom
C40  6.27,46.11 270 bottom
C41  8.4,46.11 270 bottom
C42  11.14,42.15 180 bottom
C43  11.14,37.88 180 bottom
C44  11.14,40.01 180 bottom
D1  2,34.22 90 top
FD1  85.87,52.23 0 top
FD2  84.56,52.53 0 bottom
FD3  3,17 0 top
FD4  3,71 0 top
FD5  45,70 0 top
FD6  3,71 0 bottom
FD7  3,17 0 bottom
FD8  45,72 0 bottom
FD9  19,44 0 bottom
IR_FRONT_S1  71,38 255 top
IR_FRONT_S2  71,50 105 top
IR_LEFT  64.61,53.87 135 top
IR_LEFT_S  59.76,58.15 315 top
IR_RIGHT  65.13,34.22 225 top
IR_RIGHT1  71,44 90 top
IR_RIGHT_S  60.7,30.41 45 top
J1  48.45,63.52 135 top
JP1  2.46,67.31 0 top
JP2  40,17 0 top
L1  16.05,45.52 0 bottom
L_ENCODER  35.7,68.29 270 top
L_ENCODER1  36,19.2 90 top
L_ENCODER2  2,25.69 90 top
LED1  88,12 90 bottom
LED2  88,22 90 bottom
LED3  88,32 90 bottom
LED4  88,42 90 bottom
LED5  88,56 90 bottom
LED6  88,66 90 bottom
LED7  88,76 90 bottom
LED8  88,46 90 bottom
LED9  19,16 270 bottom
LED10  19,72 270 bottom
LED11  52.2,23.95 135 top
LED12  51.75,65.74 45 top
Q1  54.8,34.76 180 top
Q2  78.9,48.1 270 top
Q3  77.03,39.55 90 top
Q4  88,9 270 bottom
Q5  88,19 270 bottom
Q6  88,29 270 bottom
Q7  88,39 270 bottom
Q8  88,49 270 bottom
Q9  88,59 270 bottom
Q10  88,69 270 bottom
Q11  88,79 270 bottom
R1  21.83,33.19 90 bottom
R2  83.76,9.01 180 top
R3  75.98,47.97 90 top
R4  39.64,69.65 180 top
R5  83.7,14.03 180 top
R6  83.55,19.2 180 top
R7  24.73,59.35 270 bottom
R8  25.03,37.1 270 bottom
R9  24,16 180 bottom
R10  83.6,23.92 180 top
R11  83.51,29.02 180 top
R12  83.34,34.03 180 top
R13  25.92,41.32 270 top
R14  23.68,41.32 270 top
R15  52.73,57.32 90 top
R16  83.53,38.94 180 top
R17  83.37,43.9 180 top
R18  83.17,49.98 180 top
R19  83.1,54.1 180 top
R20  83.3,59.13 180 top
R21  83.4,64.01 180 top
R22  83.49,69.04 180 top
R23  83.53,74.15 180 top
R24  83.59,78.91 180 top
R25  83.5,47.08 180 top
R26  66.92,49.24 180 top
R27  55.72,61.94 90 top
R28  55.7,28.16 90 top
R29  64.7,45.71 180 top
R30  80.25,39.11 270 top
R31  64.56,37.07 180 top
R32  60.82,34.26 0 top
R33  62.53,52.48 180 top
R34  58.61,55.45 270 top
R35  64.61,39.23 180 top
R36  22.08,54.58 90 bottom
R37  39.64,67.01 180 top
R38  24,72 180 bottom
R39  39.92,30.7 0 bottom
R40  31.73,26.76 90 top
R41  36,26.38 90 top
R42  32.76,36.2 180 bottom
R43  32.76,38.01 180 bottom
R44  31.57,27.52 270 bottom
RESET  43.4,21.99 135 top
U1  21.86,33.01 180 top
U2  42.68,43.88 135 top
U3  22.01,54.32 180 top
U4  11.14,46.11 0 bottom
U$1  19,75 270 top
U$2  19,13 90 top
U$3  19,44 180 top
U$4  24LC24_SOT23  [SOT23']  32.75,37 90 top
USER  48.55,29.02 135 top

### Tracks (layer width: path | path; a pad name or v marks a point on that pad's centre or on a via)
+3V3  (via drill 0.35)
  Top 0.305: R14.2 R13.2 28.39,37.9 29.15,37.9 | R14.2 23.51,40.37 | R35.2 63.66,37.11 63.54,36.99 | C29.1 C28.1 54.56,44.96 53.28,46.24 52.84,46.24 U2.27 51.97,45.44 50.94,44.41 49.72,43.2 | U2.21 49.72,42.49 49.72,43.2 | U2.20 49.21,42.31 49.21,42.69 49.72,43.2 | U2.75 32.31,44.43 C15.1 | U2.11 46.67,38.49 45.77,38.49 | R4.1 40.59,69.14 40.95,68.78 40.95,68.21 40.59,67.84 R37.1 40.41,66.82 40.41,65.92 39.8,65.31 36.53,65.31 35.53,64.31 | R41.1 L_ENCODER1.4 | R40.1 31.73,25.55 v30.04,23.86 | R25.2 82.55,49.29 | 82.55,49.66 82.55,49.98 | 82.55,49.29 82.22,49.62 R18.2 82.55,49.66 | 82.55,49.66 82.55,49.29 | U$3.P$12 18.5,41.88 17.85,41.23 | 17.85,41.23 17.24,41.23 16.02,42.45 16.02,44.28 16.49,44.75 U$3.P$8 16.23,44.75 16.02,44.96 | R14.2 18.72,40.37 17.85,41.23 | U$3.P$5 20.29,46.04 v20.29,46.11 | v17.24,45.5 16.7,44.96 16.02,44.96 | 16.02,44.96 C26.2 | 29.15,37.9 v28.52,37.27 C9.1 | 29.15,37.9 U$4.P$4
  Top 0.406: 82.55,74.29 82.55,79 R24.2 | 82.55,74.29 82.55,69.1 | 82.55,69.1 82.55,63.92 | 82.55,63.92 82.55,59.33 | 82.55,59.33 82.55,54.17 | 82.55,54.17 82.55,49.98 R18.2 | 82.55,49.29 82.55,43.81 | 82.55,43.81 82.55,38.93 82.55,38.62 | 82.55,38.62 82.55,34.05 | 82.55,34.05 82.55,28.87 | 82.55,28.87 82.55,23.99 | 82.55,23.99 82.55,19.12 | 82.55,19.12 82.55,14.22 | 82.55,14.22 82.55,9.06 82.6,9.01 R2.2 | R5.2 82.55,14.22 | R6.2 82.6,19.16 82.55,19.12 | R10.2 82.63,23.91 82.55,23.99 | R11.2 82.56,28.88 82.55,28.87 | 82.4,34.05 82.55,34.05 | R16.2 82.58,38.65 82.55,38.62 | R17.2 82.46,43.9 82.55,43.81 | R19.2 82.49,54.1 82.55,54.17 | R20.2 82.55,59.33 | R21.2 82.47,64 82.55,63.92 | R22.2 82.54,69.09 82.55,69.1 | R23.2 82.58,74.26 82.55,74.29 | 79.89,42.32 C35.1 | 64.2,31.46 63.59,31.46 61.91,33.14 61.91,34.11 R32.2 61.77,35.22 63.54,36.99 R31.2 | R29.2 v63.75,43.81 v63.74,43.81 | v62.32,37 63.55,37 63.66,37.11 | R34.2 59.56,54.5 R33.2 61.58,51.66 v62.17,51.07 | v64.96,49.29 65.91,49.29 R26.2 | 45.77,38.49 45.89,38.61 45.89,41.54 47.41,43.06 49.59,43.06 50.94,44.41 | U2.100 41.63,34.35 | 41.63,34.35 45.77,38.49 | C24.1 C6.1 41.39,34.07 41.63,34.31 41.63,34.35 | v30.04,43.67 29.28,44.43 C15.1 | R27.1 52.77,60.99 J1.1 52.73,61.03 R15.2 49.58,58.27 48.94,58.91 44.06,58.91 43.7,58.55 C5.1 | 45.77,38.49 45.59,38.49 42.23,41.84 v41.01,41.84 41.01,51.09 43.7,53.78 | U2.50 43.7,53.78 | 43.7,53.78 C5.1 | C5.1 37.43,57.32 35.53,59.22 35.53,64.31 L_ENCODER.4 | R14.2 22.68,40.37 v21.81,41.23
  Top 0.61: 82.42,37.49 R17.2 80.45,43.9 C27.1 79.93,42.35 79.89,42.32 | 82.55,38.93 82.55,34.2 82.4,34.05 R12.2 82.2,33.85 79.66,33.85 79.11,34.23 77.91,35.43 68.16,35.43 64.2,31.46 62.19,29.45 53.56,22.46 53.13,22.46 44.14,14.85 43.32,14.85 42.23,15.94 42.23,17.76 41.73,18.27 JP2.2
  Bottom 0.305: v30.04,23.86 30.04,23 | v20.29,46.11 19.68,45.5 v17.24,45.5 | R42.1 R43.1 31.08,37.27 v28.52,37.27 | R44.2 30.99,25.99 28.21,25.99 27.6,25.38 27.6,23
  Bottom 0.406: v62.32,37 63.74,38.42 v63.74,43.81 63.74,48.33 64.83,49.42 | v62.17,51.07 63.18,51.07 64.83,49.42 | 64.83,49.42 v64.96,49.29 | 30.04,42.45 30.04,39.1 29.74,38.8 27.6,38.8 24.55,41.84 21.81,41.84 | 30.04,42.45 v30.04,43.67 | 30.04,42.45 30.65,41.84 v41.01,41.84 | C44.2 13.92,41.84 21.81,41.84 | v21.81,41.23 21.81,41.84
  Bottom 0.61: 12.09,43.67 C42.2 C44.2 C43.2 12.09,35.48 9.93,33.31 9.93,22.95 10.8,22.07 C36.1 C38.1 C37.1 C7.1 C8.1 23.97,23 27.6,23 30.04,23 L_ENCODER1.4 36,23.13 37.78,23.13 40,20.91 JP2.2 | 12.09,43.67 U4.1 | L1.P$2 12.09,43.67
ADC0  (via drill 0.35)
  Top 0.305: v79.89,34.97 79.59,34.97 78.07,36.49 72.42,36.49 71.1,37.81 68.82,37.81 67.7,38.93 67.7,40.15 66.59,41.27 63.03,41.27 61.61,39.84 53.08,39.84 U2.22
  Top 0.406: R2.1 85.33,9.01 v85.38,9.06
  Bottom 0.305: v85.38,9.06 81.78,9.06 81.17,9.67 81.17,33.69 v79.89,34.97
  Bottom 0.406: v85.38,9.06 86.89,9.06 Q4.C
ADC1  (via drill 0.35)
  Top 0.305: v80.2,36.19 79.29,36.19 78.52,36.95 72.61,36.95 71.29,38.27 69.01,38.27 68.16,39.12 68.16,40.34 66.62,41.88 62.78,41.88 61.35,40.45 53.19,40.45 U2.23
  Top 0.406: R6.1 85.3,19.2 v85.38,19.12
  Bottom 0.305: v85.38,19.12 83.15,19.12 81.63,20.64 81.63,34.76 v80.2,36.19
  Bottom 0.406: v85.38,19.12 86.83,19.12 Q5.C
ADC2  (via drill 0.35)
  Top 0.305: v81.42,36.19 80.5,37.1 79.29,37.1 78.98,37.41 73.19,37.41 72.58,38.01 72.58,39.84 71.97,40.45 68.92,40.45 66.89,42.48 62.52,42.48 61.1,41.06 53.3,41.06 U2.24
  Top 0.406: R11.1 85.23,29.02 v85.38,28.87
  Bottom 0.305: v85.38,28.87 83,28.87 82.08,29.79 82.08,35.52 v81.42,36.19
  Bottom 0.406: v85.38,28.87 85.51,29 Q6.C
ADC3  (via drill 0.35)
  Top 0.305: v73.8,38.32 73.49,38.62 73.49,39.84 72.28,41.06 69.23,41.06 67.19,43.09 62.42,43.09 61,41.67 53.37,41.67 U2.25
  Top 0.406: R16.1 85.37,38.95 v85.38,38.93
  Bottom 0.305: v85.38,38.93 83.55,37.1 75.02,37.1 v73.8,38.32
  Bottom 0.406: v85.38,38.93 86.88,38.93 Q7.C
ADC4  (via drill 0.35)
  Top 0.305: U2.28 53.39,47.51 62.17,47.51 62.67,47.01 66.74,47.01 67.25,46.5 70.8,46.5 74.51,50.21 v79.29,50.21
  Top 0.406: R18.1 84.12,49.94 v85.08,48.99
  Bottom 0.305: v85.08,48.99 83.6,50.46 79.54,50.46 v79.29,50.21
  Bottom 0.406: v85.08,48.99 86.94,48.99 Q8.C
ADC5  (via drill 0.35)
  Top 0.305: U2.29 53.18,48.02 62.42,48.02 62.93,47.51 68.26,47.51 70.8,50.05 72.07,50.05 73.44,51.43 v79.29,51.43
  Top 0.406: R20.1 84.99,59.13 v85.08,59.05
  Bottom 0.305: v85.08,59.05 82.69,59.05 82.08,58.44 82.08,54.22 v79.29,51.43
  Bottom 0.406: v85.08,59.05 86.9,59.05 Q9.C
ADC6  (via drill 0.35)
  Top 0.305: v79.59,52.95 78.68,52.03 76.85,52.03 76.54,52.34 69.23,52.34 67.45,50.56 64.96,50.56 62.93,48.53 52.97,48.53 U2.30
  Top 0.406: R22.1 85.01,69.03 v85.08,69.1
  Bottom 0.305: v85.08,69.1 82.64,69.1 81.63,68.09 81.63,54.98 v79.59,52.95
  Bottom 0.406: v85.08,69.1 86.85,69.1 Q10.C
ADC7  (via drill 0.35)
  Top 0.305: v78.2,53.05 68.72,53.05 66.74,51.07 64.71,51.07 62.67,49.04 52.8,49.04 U2.31
  Top 0.406: R24.1 85.33,78.91 v85.38,78.86
  Bottom 0.305: v85.38,78.86 82.69,78.86 81.17,77.33 81.17,55.52 81.08,55.43 81.06,55.32 80.75,55.1 79.52,53.86 78.97,53.86 78.08,53.24 78.08,53.18 v78.2,53.05
  Bottom 0.406: v85.38,78.86 86.81,78.86 Q11.C
ADC8  (via drill 0.35)
  Top 0.305: IR_FRONT_S1.K 67.32,36.77 66.74,37.35 66.74,38.62 66.13,39.23 R35.1 65.56,40.06 65.21,40.4 62.93,40.4 61.4,38.88 v59.88,38.88 | U2.32 52.84,49.8 v53.78,49.8
  Bottom 0.305: v59.88,38.88 57.09,41.67 57.09,46.75 54.04,49.8 v53.78,49.8
ADC9  (via drill 0.35)
  Top 0.305: v55.95,52.21 54.53,52.21 U2.33
  Top 0.406: R26.1 69.85,51.23 IR_FRONT_S2.K
  Bottom 0.305: IR_FRONT_S2.K 69.75,50.31 65.21,50.31 63.69,51.83 60.9,51.83 60.13,51.07 56.58,51.07 56.07,51.58 56.07,52.09 v55.95,52.21
ADC10  (via drill 0.35)
  Top 0.305: R32.1 59.87,35.06 60.9,36.08 60.9,36.85 v59.88,37.86 | U2.34 52.77,51.13 52.77,52.34 53.21,52.78 v53.21,52.82
  Top 0.406: IR_RIGHT_S.K 60.69,31.31 59.78,32.22 59.78,34.16 R32.1
  Bottom 0.305: v59.88,37.86 60.64,37.86 61.15,38.37 61.15,38.88 57.59,42.43 57.59,47.26 53.38,51.47 53.28,51.58 53.21,51.65 v53.21,52.82
ADC11
  Top 0.305: U2.35 52.01,51.08 52.01,52.85 54.42,55.26 54.55,55.39 55.55,56.4 59,56.4
  Top 0.406: R34.1 59,56.4 59.8,56.4 IR_LEFT_S.K
BOOT  (via drill 0.35)
  Top 0.305: v37.66,25.69 v37.66,30.26 | U2.94 40.62,37.58 v41.62,37.58
  Bottom 0.305: JP2.1 41.42,15.73 42.54,16.85 42.54,20.81 v37.66,25.69 | v37.66,30.26 38.54,30.26 R39.2 38.98,33.4 41.62,36.05 v41.62,37.58
GND  (via drill 0.35)
  Top 0.305: U1.18 17.79,32.76 v17.41,33.14 | C1.2 13.85,34.75 12.84,33.75 v11.93,33.75 | U3.18 17.2,54.07 16.65,54.63 C13.2 16.65,55.24 v15.89,54.47 | U2.26 53.4,45.1 53.56,44.94 54.78,43.72 | 55.09,43.42 55.24,43.27 54.63,43.27 v54.43,43.06 | C28.2 C29.2 | v74.36,46.75 75.71,46.75 R3.1 | U2.99 39.49,32.89 C6.2 C24.2 39,28.11 RESET.2 RESET.1 44.62,18.02 v45.28,18.68 | v49.24,22.34 50.58,22.34 LED11.C 50.96,23.43 USER.1 USER.2 | U2.74 32.44,46.33 C15.2 27.91,46.33 27.91,48.24 C19.2 | C22.2 57.66,31.66 58.39,32.39 58.39,37.27 57.78,37.88 57.17,37.88 | 57.17,37.88 56.91,37.88 C21.2 | U2.19 51.7,39.1 52.6,39.1 | 57.17,37.88 57.17,38.49 56.56,39.1 52.6,39.1 | U2.10 48.09,36.36 v48.33,36.36 | v51.99,38.49 52.6,39.1 | U2.49 45.6,54.6 45.6,57.08 | 45.6,57.08 C5.2 46.2,56.73 v46.2,56.17 | 45.6,57.08 47.1,57.08 C23.1 48.37,56.97 C25.1 | IR_LEFT_S.A 61.81,59.05 62.32,58.64 67.53,53.43 67.53,53.12 v66.62,52.21 | U$3.P$7 U$3.P$6 | 19,44.28 19,44.05 19.3,43.75 U$3.P$2 U$3.P$1 | 19,44.28 U$3.P$6 | U$3.P$3 19.03,44.25 19,44.28 | U$3.P$6 19,47.26 19.07,47.33 | C26.1 15.75,47.06 16.02,47.33 | U$4.P$2 31.35,37 U$4.P$5 30.37,36.02 C9.2
  Top 0.406: R3.1 76.11,47.15 Q2.2 77.46,46.8 v77.46,45.94 78.03,45.37 C27.2 C35.2 78.13,42.18 Q3.2 79.81,40.5 R30.1 v81.03,40.84 | C6.2 39.49,31.78 v40.1,32.39 | v52.6,44.28 53.26,44.94 53.56,44.94 | 53.4,45.1 54.78,43.72 | 54.78,43.72 55.09,43.42 | 55.24,43.27 55.45,43.06 C28.2 | v54.43,43.06 54.78,43.42 54.78,43.72 | C15.2 21.59,46.33 20.59,47.33 19.07,47.33 16.02,47.33 10.53,47.33 9.32,48.55 v9.32,48.85 | LED12.C 49.14,68.36 47.72,68.36 46.65,67.3 J1.7 J1.8
  Top 0.61: v11.93,33.75 11.88,33.71 | C34.- 8.99,62.29 8.99,59.85 v9.49,59.35 | v76.54,41.98 77.92,41.98 78.13,42.18 | v76.54,43.2 77.76,44.41 C27.2 | C4.- 8.1,35.33 v8.1,37.58
  Top 1.27: JP1.1 6.12,62.38 | C34.- 6.12,62.38 | 6.12,62.38 6.12,55.1 3.52,52.51 3.52,40.93 9.01,35.44 C4.- | 9.81,33.61 8.4,33.61 9.01,34.22 C4.- | 9.81,33.61 11.79,33.61 v11.93,33.75 v11.93,31.61 | C4.- 9.81,33.61
  Bottom 0.305: v17.41,33.14 18.93,33.14 19.85,32.22 21.82,32.22 R1.1 | v15.89,54.47 15.89,53.73 15.89,53.62 | IR_FRONT_S2.A 72.34,48.77 72.64,48.47 | 72.64,48.47 v74.36,46.75 | 46.5,16.85 46.5,17.46 v45.28,18.68 | v49.24,22.34 50.79,20.79 50.79,20.48 | v48.33,36.36 50.46,38.49 50.77,38.49 | 50.77,38.49 v51.99,38.49 | 50.77,38.49 54.43,42.15 v54.43,43.06 | v66.62,52.21 70.6,52.21 70.81,52.26 70.91,52.21 71.8,52.21 73.32,50.68 73.32,49.16 72.64,48.47 | R39.1 40.88,31.62 v40.1,32.39
  Bottom 0.406: C16.2 24.73,51.89 C32.1 | C20.2 25.03,31.61 24.42,31 | Q11.E 89.05,78.56 88.12,77.64 88.12,69.1 | Q4.E 88.49,9 88.12,9.36 88.12,18.81 | 88.12,69.1 88.12,59.05 | 88.12,59.05 88.12,49 Q8.E 89.05,48.12 87.95,47.02 87.95,40.32 | 88.12,29.18 88.12,18.81 | Q5.E 88.86,18.81 88.12,18.81 | Q6.E 88.3,29 88.12,29.18 | 88.12,59.05 89,59.05 Q9.E | 88.12,69.1 88.95,69.1 Q10.E | IR_RIGHT_S.A 60.37,28.95 60.37,27.98 | C36.2 13.28,20.64 | C8.2 23.03,20.64 | C7.2 20.59,20.64 | C37.2 18.15,20.64 | C38.2 15.72,20.34 16.02,20.64 | 25.79,29.63 v26.55,30.39 | v52.6,44.28 46.2,50.68 v46.2,56.17 46.2,60.44 44.06,62.57 44.06,64.52 J1.8 44.86,68.48 41.24,72.1 L_ENCODER.1 | v48.33,36.36 44.37,32.39 v40.1,32.39 | v77.46,45.94 79.11,44.28 | v9.32,48.85 9.32,47.98 C41.1 | 87.95,40.32 87.95,40.1 Q7.E 89.05,37.76 88.12,36.83 88.12,29.18 | v81.03,40.84 83.17,40.84 83.69,40.32 87.95,40.32
  Bottom 0.61: v11.93,33.75 11.93,32.83 | 15.89,53.62 13.08,53.62 9.49,57.22 v9.49,59.35 9.49,56 | 13.28,20.64 16.02,20.64 18.15,20.64 20.59,20.64 23.03,20.64 32.96,20.64 33.26,20.34 33.26,18.73 33.82,18.17 33.82,15.51 33.95,15.38 L_ENCODER1.1 37.06,14.32 43.53,14.32 44.94,15.46 | 45.67,16.14 46.5,16.85 48.34,18.4 50.79,20.48 56.63,25.42 57.21,25.42 60.37,27.98 62.19,29.45 68.92,36.19 68.92,38.93 70.14,40.15 72.28,40.15 72.28,39.23 | 75.63,41.98 72.88,39.23 72.28,39.23 | v76.54,41.98 75.63,41.98 | 75.63,41.98 75.63,42.89 75.93,43.2 v76.54,43.2 | IR_FRONT_S1.A 72.28,39.23 | 11.93,32.83 13.28,31.48 21.07,31.48 R1.1 23.64,31.79 24.42,31 25.79,29.63 25.47,29.31 C18.1 C17.1 | v28.38,51.73 26.87,51.73 C33.1 24.7,51.77 C32.1 22.81,51.82 21.98,52.65 21.98,53.52 R36.1 16.44,53.17 15.89,53.73 | v11.93,31.61 11.93,32.83 | C43.1 10.19,39.67 | 10.19,39.67 C44.1 C42.1 6.44,42.15 | 5.96,42.15 4.44,43.67 4.44,46.72 4.78,47.06 C40.1 C41.1 9.77,47.06 U4.4 | v8.1,37.58 8.71,38.19 | 8.71,38.19 10.19,39.67 | C36.2 9.01,20.17 | 9.01,20.17 8.13,20.17 7.18,21.12 7.18,36.97 8.4,38.19 8.71,38.19 | L_ENCODER2.1 2.15,21.88 4.13,19.9 8.74,19.9 9.01,20.17
  other vias: 10.71,59.35 78.98,45.94 32.04,21.86 43.62,21.86 51.55,31.61 61.61,44.42 33.87,30.39 42.4,36.49 44.54,41.37 38.75,45.63 46.06,46.24 25.03,47.16 31.43,56 34.48,62.09 38.75,53.25 40.27,72.46 10.4,70.02 27.16,70.02 26.86,58.13 18.33,18.2 10.4,18.2 39.66,27.04 58.86,36.8 74.1,44.11 58.25,52.34 55.51,58.44 31.43,63.62 88.99,74.03 89.08,14.19 31.43,46.24 26.86,35.88 42.71,60.87 7.96,41.06 5.52,49.29 14.97,39.54 31.43,40.76 38.14,40.45 47.59,52.64
  pour Bottom: -8.06,96.71 94.96,96.71 94.96,-4.49 -8.06,-4.49
  pour Top: -1.66,99.15 112.95,99.15 112.95,-8.75 -1.66,-8.75
IR_LED_CONTROLL  (via drill 0.35)
  Top 0.305: Q3.1 77.85,38.32 75.32,38.32 74.41,39.23 74.41,41.37 74.1,41.67 69.53,41.67 v66.99,44.21 | U2.8 48.63,34.41 v48.63,34.22
  Top 0.406: R30.2 79.81,38.6 Q3.1
  Bottom 0.305: v66.99,44.21 66.99,39.39 61.66,34.05 48.81,34.05 v48.63,34.22
IR_LED_FRONT  (via drill 0.35)
  Top 0.406: v76.24,40.45 75.93,40.15 Q3.3
  Bottom 0.406: IR_RIGHT.K 64.24,35.46 65.27,36.49 65.87,36.49 68.01,38.62 68.01,43.81 69.53,45.33 70.94,45.33 IR_RIGHT1.K 75.63,45.27 | v76.24,40.45 77.15,40.45 78.37,41.67 78.37,43.2 76.3,45.27 75.63,45.27 | 75.63,45.27 75.63,50.82 73.34,53.1 68.01,53.1 65.72,55.39 64.34,55.39 IR_LEFT.K
KEY
  Top 0.305: U2.3 46.07,33.42 USER.4
L_A
  Top 0.305: U2.66 29.38,55.07 U3.6
L_B
  Top 0.305: U2.65 29.59,55.57 U3.7
L_C
  Top 0.305: U2.64 29.78,56.07 U3.8
L_ENABLE
  Top 0.305: U3.2 26.68,53.07 26.86,53.25 26.86,53.56 | U3.5 26.46,54.57 26.86,54.17 | 26.86,54.17 26.86,53.56 | U3.3 26.85,53.57 26.86,53.56 | U3.4 26.76,54.07 26.86,54.17 | U2.67 30.37,53.36 27.06,53.36 26.86,53.56
L_I  (via drill 0.35)
  Top 0.305: U2.18 48.94,41.15 48.94,41.54 v48.33,42.15
  Bottom 0.305: v48.33,42.15 47.76,42.15 46.99,42.91 36.14,42.91 35.98,42.91 32.94,42.91 29.43,46.41 29.43,53.43 26.69,56.17 24.86,56.17 C16.1
  Bottom 0.406: R7.2 C16.1
L_SCL
  Top 0.305: R37.2 38.67,67.02 L_ENCODER.3 33.51,64.83 33.51,55.25 33.51,54.46 U2.61
L_SDA
  Top 0.305: R4.2 35.79,69.65 L_ENCODER.2 35.51,69.56 32.96,67.01 32.96,55.25 32.96,54.33 U2.62
L_YA
  Top 0.406: U3.26 U3.9 23.41,58.03 24.12,58.74 24.12,60.87 22.69,62.3 U$1.P$1
L_YB
  Top 0.406: U3.24 U3.11 21.98,56.41 21.98,59.35 21.37,59.96 19.98,59.96 | 19.98,59.96 19.85,59.96 | 19.98,59.96 19,60.94 U$1.P$2
L_YC
  Top 0.406: U3.22 U3.13 20.61,57.98 18.15,60.44 16.94,60.44 16.46,60.91 U$1.P$3
LED_1
  Top 0.305: R28.2 53.44,29.11 52.6,29.96 50.77,29.96 48.81,29.96 U2.2
LED_2  (via drill 0.35)
  Top 0.305: U2.1 47.11,30.98 v47.11,29.04 | v28.82,25.08 24.86,21.12 v24.86,17.76
  Bottom 0.305: v47.11,29.04 36.44,29.04 32.48,25.08 v28.82,25.08 | v24.86,17.76 24.86,16.09 R9.2
LED_3  (via drill 0.35)
  Top 0.305: U2.60 34,54.68 34,56.47 v34.61,57.08 | v31.57,59.52 27.91,63.18 27.91,67.75 26.69,68.97 v25.16,68.97
  Bottom 0.305: v34.61,57.08 32.17,59.52 v31.57,59.52 | v25.16,68.97 24.95,69.19 R38.2
LINE_LED  (via drill 0.35)
  Top 0.406: Q2.3 81.11,46.99 v81.11,45.94 | v90.09,44.28 89.78,43.98 v85.82,43.98
  Bottom 0.406: 91.78,56 91.78,66 | 91.78,56 91.78,47.63 | 91.78,47.63 91.78,44.28 | 91.78,44.28 91.78,42 | 91.78,32 91.78,22 | LED2.C 91.78,22 | LED3.C 91.78,32 | 89.95,41.8 LED4.C 91.78,42 | LED7.C 89.76,76 91.78,73.98 91.78,67.45 91.78,66.84 91.78,66 | 91.78,42 91.78,32 | LED8.C 90.15,46 91.78,47.63 | LED5.C 91.78,56 | LED6.C 91.78,66 | v81.11,45.94 83.86,45.94 v85.82,43.98 | v90.09,44.28 91.78,44.28 | LED1.C 91.03,12 91.78,12.75 91.78,22
LINE_LED_CONTROLL  (via drill 0.35)
  Top 0.305: 75.75,48.68 R3.2 75,48.92 73.09,47.01 v73.09,46.5 | U2.9 48.02,35.7 48.02,35.67 48.25,35.44 v49.24,35.44
  Top 0.406: R3.2 76.11,49.05 Q2.1
  Bottom 0.305: v73.09,46.5 68.01,46.5 65.47,43.96 65.47,38.62 61.74,34.9 | 61.74,34.9 61.74,34.83 | v49.24,35.44 49.85,34.83 61.68,34.83 61.74,34.9
MEM_SCL  (via drill 0.35)
  Top 0.305: U2.85 35.22,38.54 35.22,36.66 34.92,36.36 | 34.92,36.36 34.61,36.05 33.3,36.05 U$4.P$1 | v34.92,35.75 34.92,36.36
  Bottom 0.305: R42.2 34.16,35.75 v34.92,35.75
MEM_SDA  (via drill 0.35)
  Top 0.305: U2.84 33.86,37.9 U$4.P$3 33.25,38.63 v33.09,38.8
  Bottom 0.305: R43.2 33.09,38.63 v33.09,38.8
N$1  (via drill 0.35)
  Top 0.406: U3.12 21.31,58.5 v20.76,59.05 | U3.10 22.71,58.86 v22.9,59.05
  Bottom 0.406: v20.76,59.05 21.37,58.44 21.37,55.69 21.54,55.52 R36.2 22.09,56.4 22.9,57.22 v22.9,59.05 22.9,59.96 23.24,60.3 R7.1
N$2
  Top 0.305: U1.14 16.91,36.95 C1.1
N$3
  Top 0.305: C2.1 18.75,31.26 U1.21
N$4
  Top 0.305: U1.20 17.56,31.76 16.25,30.45 C2.2
N$5
  Top 0.305: U1.19 16.58,32.26 C3.1
N$7
  Top 0.406: R29.1 68.02,45.71 IR_RIGHT1.A
N$8  (via drill 0.35)
  Top 0.406: U1.12 21.16,37.62 v21.07,37.71 | U1.10 22.56,37.37 v22.9,37.71
  Bottom 0.406: v21.07,37.71 21.37,37.41 21.37,34.36 21.59,34.14 R1.2 22.07,34.14 22.29,34.36 22.29,37.1 v22.9,37.71 24.69,37.71 R8.1
N$9
  Bottom 0.305: R9.1 LED9.A
N$10
  Top 0.305: U3.14 19.25,56.59 17.98,57.86 C13.1
N$11
  Bottom 0.305: R38.1 LED10.A
N$12
  Top 0.305: U3.19 15.9,53.57 14.97,52.65 14.97,52.33 C31.1
N$13
  Top 0.406: R33.1 65.02,52.48 IR_LEFT.A
N$14  (via drill 0.35)
  Top 0.406: R5.1 85.17,14.03 v85.38,14.24
  Bottom 0.406: v85.38,14.24 85.38,12.87 LED1.A
N$15  (via drill 0.35)
  Top 0.406: R10.1 84.62,23.99 v85.38,23.99
  Bottom 0.406: v85.38,23.99 86.25,23.12 LED2.A
N$16  (via drill 0.35)
  Top 0.406: R12.1 84.79,34.03 v85.08,33.75
  Bottom 0.406: v85.08,33.75 85.08,33.17 LED3.A
N$17  (via drill 0.35)
  Top 0.305: v84.3,41.84 84.3,43.88 R17.1
  Bottom 0.406: LED4.A 86.09,41.84 v84.3,41.84
N$18  (via drill 0.35)
  Top 0.406: R19.1 84.71,54.1 v84.77,54.17
  Bottom 0.305: v84.77,54.17 85.34,54.17 86.25,55.08 LED5.A
N$19  (via drill 0.35)
  Top 0.406: R21.1 84.99,64 v85.08,63.92
  Bottom 0.305: v85.08,63.92 86.25,65.1 LED6.A
N$20  (via drill 0.35)
  Top 0.406: R23.1 84.91,74.15 v85.08,73.98
  Bottom 0.406: v85.08,73.98 85.08,74.83 LED7.A
N$21  (via drill 0.35)
  Top 0.305: 84.53,47.16 85.07,47.16 v85.21,47.02
  Top 0.406: R25.1 84.53,47.16
  Bottom 0.305: v85.21,47.02 85.22,47.02
  Bottom 0.406: 85.22,47.02 LED8.A
N$22
  Bottom 0.61: U4.6 13.62,49.01 C39.2
N$23
  Top 0.406: R27.2 54.61,62.89 LED12.A
N$24
  Top 0.406: IR_RIGHT.A 65.51,35.64 R31.1
N$25
  Top 0.305: U2.73 31.07,48.41 C19.1
N$26
  Bottom 0.61: L1.P$1 13.93,47.37 12.67,46.11 11.45,46.11 11.14,46.41 U4.5 11.14,48.89 C39.1
N$28
  Top 0.61: D1.A L_ENCODER2.4
N$30
  Top 0.305: U2.48 47.49,55.76 C23.2
N$31
  Top 0.305: U3.21 19.2,52.52 C30.1
N$33
  Top 0.305: LED11.A 55.46,27.21 R28.1
N$34
  Top 0.305: U3.20 17.84,53.07 17.3,52.53 C30.2
OSCIN
  Top 0.305: Q1.3 52.29,33.56 | 52.29,33.56 51.43,33.56 50.16,34.83 50.16,35.69 U2.12 | C22.1 53.33,31.66 52.29,32.7 52.29,33.56
OSCOUT
  Top 0.305: U2.13 49.3,37.27 54.4,37.27 C21.1 54.98,36.41 55.43,35.96 Q1.1
R_A
  Top 0.305: U1.6 37.52,33.76 U2.95
R_B
  Top 0.305: U1.7 36.58,34.26 U2.93
R_C
  Top 0.305: U1.8 36.4,34.76 U2.92
R_ENABLE
  Top 0.305: U1.2 26.4,31.76 26.55,31.92 26.55,32.22 | U1.5 26.13,33.26 26.55,32.83 | 26.55,32.83 26.55,32.53 | 26.55,32.53 26.55,32.22 | U1.4 26.48,32.76 26.55,32.83 | U1.3 26.52,32.26 26.55,32.22 | 26.55,32.53 36.97,32.53 U2.96
R_I  (via drill 0.35)
  Top 0.305: U2.17 48.48,40.93 v48.02,40.93
  Bottom 0.305: v48.02,40.93 47.72,41.23 47.72,41.54 46.81,42.45 42.84,42.45 34.17,33.78 C20.1
  Bottom 0.406: R8.2 C20.1
R_SCL
  Top 0.305: U2.98 34,28.12 34,27.52 | 34,27.52 34,21.42 34.84,20.59 36,20.59 L_ENCODER1.3 | R41.2 34.19,27.33 34,27.52
R_SDA
  Top 0.305: U2.97 33.39,28.23 33.39,28.13 | 33.39,28.13 33.39,20.2 34.31,19.29 35.22,19.29 36,18.51 L_ENCODER1.2 | R40.2 32.98,27.71 33.39,28.13
R_YA
  Top 0.406: U1.9 U1.26 23.26,30.04 24.42,28.87 24.42,27.69 22.43,25.7 U$2.P$3
R_YB
  Top 0.406: U1.11 U1.24 21.86,28.17 21.25,27.56 21.08,27.56 21.03,27.52 19.68,27.52 19,26.84 U$2.P$2
R_YC
  Top 0.406: U1.13 U1.22 20.46,29.48 20.02,29.04 19.07,29.04 16.46,26.43 U$2.P$1
RESET  (via drill 0.35)
  Top 0.305: RESET.3 RESET.4 42.54,26.75 v42.54,33.61 | U2.14 46.81,40.48 v46.81,41.23 | v49.55,53.73 49.55,54.18 C25.2 51.44,55.07 R15.1
  Bottom 0.305: v42.54,33.61 42.54,34.83 46.35,38.64 | 46.35,38.64 46.81,39.1 v46.81,41.23 | 46.35,38.64 48.18,38.64 53.51,43.98 53.51,47.63 49.55,51.6 v49.55,53.73 49.55,59.23 J1.2
SCL  (via drill 0.35)
  Top 0.305: 24.55,43.37 v24.55,43.32 24.55,43.14 R14.1 23.5,42.45 21.81,42.45 20.59,41.23 19.37,41.23 19,41.61 U$3.P$13 | v27.6,40.32 28.48,40.32 29.27,39.53 34.74,39.53 35.39,40.18 U2.83
  Bottom 0.305: v24.55,43.32 27.55,40.32 v27.6,40.32
SDA
  Top 0.305: U2.82 34.55,39.98 34.19,39.98 34.16,40.01 29.43,40.01 27.16,42.29 25.95,42.29 R13.1 25.92,43.53 25.16,44.28 22.73,44.28 20.29,41.84 19.68,41.84 19.5,42.02 U$3.P$14
SWCLK  (via drill 0.35)
  Top 0.305: J1.4 46.25,59.52 v42.84,59.52 | U2.76 v34.3,43.98 v34.31,43.98
  Bottom 0.305: v34.31,43.98 41.32,50.99 41.32,54.95 42.84,56.47 v42.84,59.52
SWDIO  (via drill 0.35)
  Top 0.305: U2.72 30.96,49.25 v30.96,50.68 | v38.27,61.05 40.74,63.52 J1.6
  Bottom 0.305: v30.96,50.68 38.27,58 v38.27,61.05
UART_RX  (via drill 0.35)
  Top 0.305: U2.69 34.08,48.24 33.09,48.24 32.17,49.16 v32.17,49.77 | J1.3 49.7,64.07 49.7,65.83 48.97,66.56 47.86,66.56 45.37,64.07 44.34,64.07 44.32,64.09 38.88,64.09 36.75,61.96 v36.75,60.13
  Bottom 0.305: v32.17,49.77 39.8,57.39 39.8,61.66 39.49,61.96 37.66,61.96 36.75,61.05 v36.75,60.13
UART_TX  (via drill 0.35)
  Top 0.305: U2.68 34.19,48.85 33.7,48.85 v33.39,49.16 | v41.32,61.96 41.63,62.27 47.17,62.27 47.9,63 47.9,64.76 J1.5
  Bottom 0.305: v33.39,49.16 41.01,56.78 41.01,60.74 41.01,61.05 41.01,61.66 v41.32,61.96
USBDM  (via drill 0.35)
  Top 0.305: L_ENCODER2.3 5,26.96 5.96,25.99 5.96,23.25 6.88,22.34 22.42,22.34 30.04,29.96 v30.04,30.87 | U2.70 40.98,40.62 41.93,40.62 v42.23,40.32
  Bottom 0.305: v30.04,30.87 31.87,32.7 34.31,32.7 41.17,39.56 41.47,39.56 v42.23,40.32
USBDP  (via drill 0.35)
  Top 0.305: L_ENCODER2.2 4.49,24.42 5.05,23.86 5.05,22.95 6.27,21.73 22.73,21.73 v31.57,30.57 | U2.71 42.44,38.49 v42.54,38.49
  Bottom 0.305: v42.54,38.49 41.93,39.1 41.62,39.1 34.82,32.3 34.81,32.3 34.3,31.79 32.78,31.79 v31.57,30.57 R44.1
VCC  (via drill 0.35)
  Top 0.305: C3.2 14.06,32.66 v14.06,28.26
  Top 0.406: U1.23 21.16,28.65 21.07,28.57 v20.76,28.57 | v23.2,28.26 22.56,28.91 U1.25 | U3.23 21.31,49.97 21.68,49.6 | U3.25 22.71,49.71 22.59,49.6
  Top 0.61: 22.59,49.6 21.98,49.6 | 21.98,49.6 21.68,49.6 | 21.98,49.6 21.07,48.68 | 9.62,54.08 11.1,54.08 12.53,52.65 12.53,49.9 13.75,48.68 15.28,48.68 | 21.07,48.68 15.28,48.68 | C31.2 15.12,48.84 15.28,48.68 | 8.84,53.85 C34.+ | v22.59,48.68 21.07,48.68 | v7.49,44.28 7.49,50.07 8.55,51.14 | D1.C 2,37.88
  Top 0.813: 12.13,54.88 11.09,53.85 10.53,53.85 8.84,53.85
  Top 1.27: JP1.2 4.96,68.58 5.7,67.85 10.13,67.85 12.36,65.62 12.36,55.67 10.53,53.85 | 9.62,54.08 C34.+ 9.08,51.67 | 2.46,56.32 2,55.86 2,37.88 2,36.36 9.01,29.35 C4.+ 9.01,25.38 9.32,25.08 11.49,25.08 v11.62,25.21 | 2.46,56.32 3.83,57.69 v4.13,57.69 | v9.62,50.68 9.08,51.22 9.08,51.67 | 2.46,56.32 2.46,58.91 2.76,59.22 | v4.13,59.22 2.76,59.22 | 9.08,51.67 8.55,51.14 v8.1,50.68 v6.88,50.68 | 2.76,59.22 2.76,60.28 3.22,60.74 v4.13,60.74
  Bottom 0.305: v14.06,28.26 14.06,27.04
  Bottom 0.61: v11.62,25.21 12.23,25.21 14.06,27.04 15.58,28.57 v20.76,28.57 22.9,28.57 v23.2,28.26 24.29,27.18 C18.2 C17.2 | C33.2 24.7,49.87 C32.2 23.83,49.92 v22.59,48.68 | 9.93,50.38 v9.62,50.68 | 9.62,52.21 9.32,51.9 | U4.2 U4.3 8.83,44.73 C41.2 C40.2 6.61,45.16 v7.49,44.28
  Bottom 1.27: 9.62,51.6 9.62,52.21 v4.13,57.69 v4.13,59.22 v4.13,60.74 | 9.62,51.6 v9.62,50.68 | 9.62,51.6 8.71,50.68 v8.1,50.68

### Text on the board
tValues: +